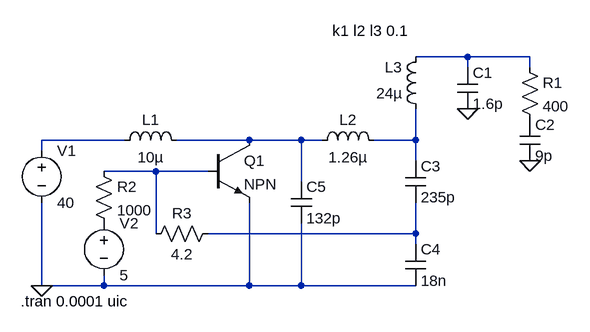
[diagram p0: schematic SteveWardFlame.asc]
SteveWardFlame.asc, the LTspice schematic file:
Version 4.1
SHEET 1 880 680
WIRE 592 16 512 16
WIRE 688 16 592 16
WIRE 592 32 592 16
WIRE 688 32 688 16
WIRE 64 144 -64 144
WIRE 256 144 144 144
WIRE 336 144 256 144
WIRE 368 144 336 144
WIRE 512 144 512 96
WIRE 512 144 448 144
WIRE -64 160 -64 144
WIRE 512 176 512 144
WIRE 112 192 32 192
WIRE 192 192 112 192
WIRE 336 208 336 144
WIRE 112 288 112 192
WIRE 512 288 512 240
WIRE 512 288 192 288
WIRE 512 304 512 288
WIRE -64 368 -64 240
WIRE 32 368 32 352
WIRE 32 368 -64 368
WIRE 256 368 256 240
WIRE 256 368 32 368
WIRE 336 368 336 272
WIRE 336 368 256 368
WIRE 512 368 336 368
FLAG 592 96 0
FLAG 688 176 0
FLAG -64 368 0
SYMBOL voltage -64 144 R0
WINDOW 123 0 0 Left 0
WINDOW 39 0 0 Left 0
SYMATTR InstName V1
SYMATTR Value 40
SYMBOL ind 48 160 R270
WINDOW 0 32 56 VTop 2
WINDOW 3 5 56 VBottom 2
SYMATTR InstName L1
SYMATTR Value 10µ
SYMBOL ind 352 160 R270
WINDOW 0 32 56 VTop 2
WINDOW 3 5 56 VBottom 2
SYMATTR InstName L2
SYMATTR Value 1.26µ
SYMATTR Type ind
SYMBOL ind 528 112 R180
WINDOW 0 36 80 Left 2
WINDOW 3 36 40 Left 2
SYMATTR InstName L3
SYMATTR Value 24µ
SYMATTR Type ind
SYMBOL cap 576 32 R0
SYMATTR InstName C1
SYMATTR Value 1.6p
SYMBOL cap 672 112 R0
SYMATTR InstName C2
SYMATTR Value 9p
SYMBOL res 672 16 R0
SYMATTR InstName R1
SYMATTR Value 400
SYMBOL cap 496 176 R0
SYMATTR InstName C3
SYMATTR Value 235p
SYMBOL cap 496 304 R0
SYMATTR InstName C4
SYMATTR Value 18n
SYMBOL cap 320 208 R0
SYMATTR InstName C5
SYMATTR Value 132p
SYMBOL voltage 32 256 R0
WINDOW 123 0 0 Left 0
WINDOW 39 0 0 Left 0
SYMATTR InstName V2
SYMATTR Value 5
SYMBOL res 16 176 R0
SYMATTR InstName R2
SYMATTR Value 1000
SYMBOL res 208 272 R90
WINDOW 0 0 56 VBottom 2
WINDOW 3 32 56 VTop 2
SYMATTR InstName R3
SYMATTR Value 4.2
SYMBOL npn 192 144 R0
SYMATTR InstName Q1
TEXT 384 -24 Left 2 !k1 l2 l3 0.1
TEXT -96 392 Left 2 !.tran 0.0001 uic

The netlist it stands for:
* SteveWardFlame.asc
V1 N002 0 40
L1 N002 N003 10µ
L2 N003 N004 1.26µ
L3 N004 N001 24µ
C1 N001 0 1.6p
C2 P001 0 9p
R1 N001 P001 400
C3 N004 N006 235p
C4 N006 0 18n
C5 N003 0 132p
V2 P002 0 5
R2 N005 P002 1000
R3 N006 N005 4.2
Q1 N003 N005 0 0 NPN
.model NPN NPN
.model PNP PNP
.lib standard.bjt
k1 l2 l3 0.1
.tran 0.0001 uic
.backanno
.end